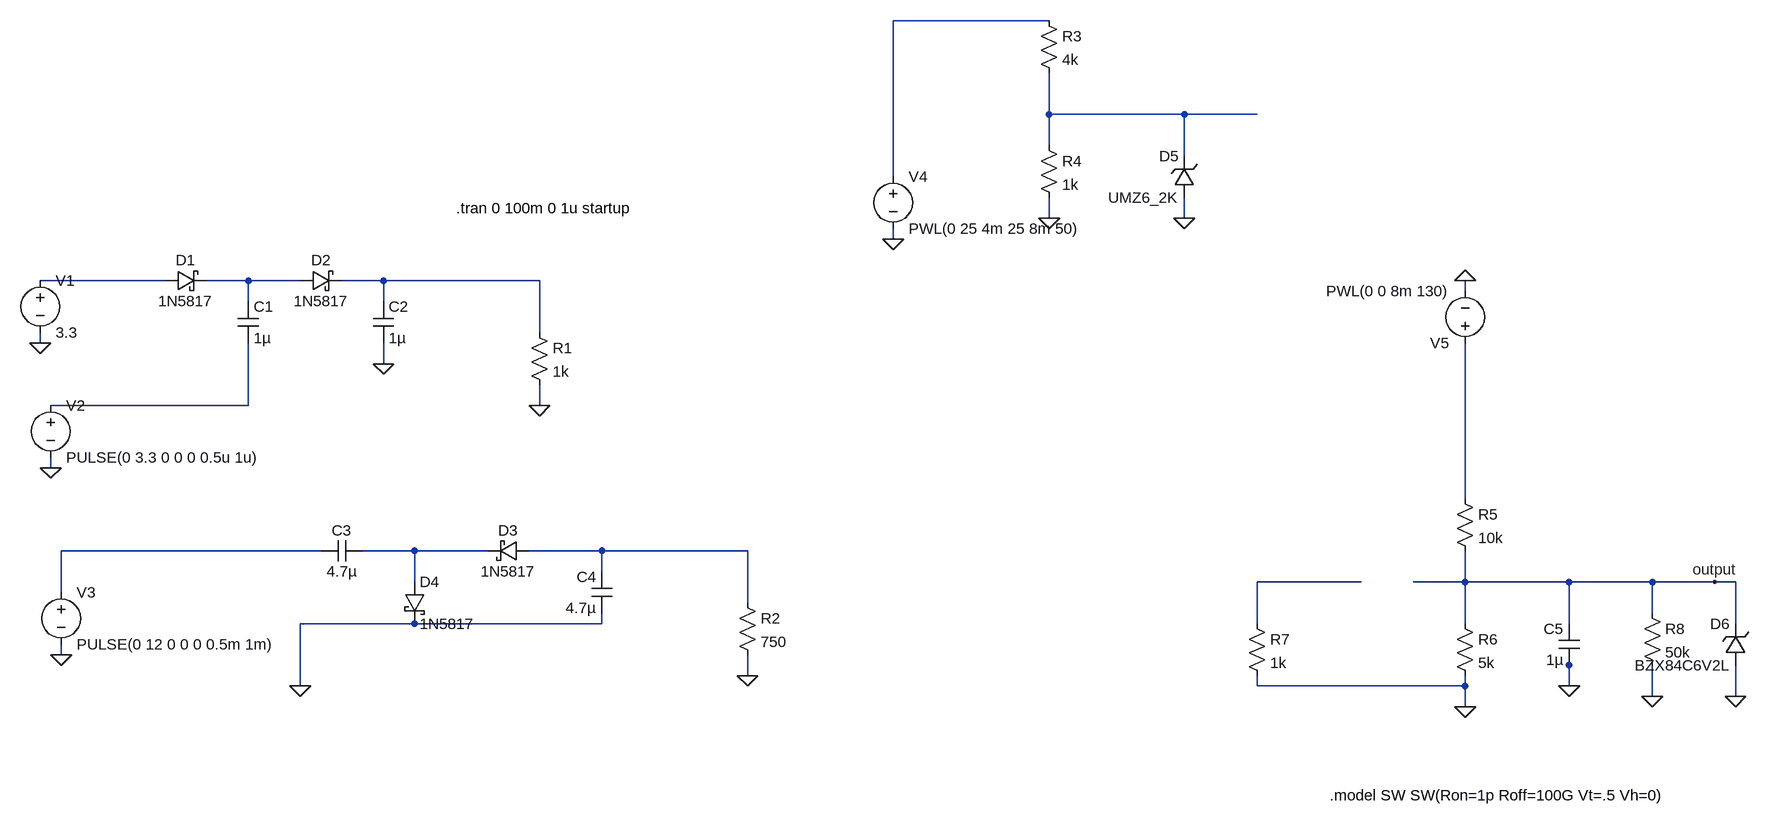
[diagram p0: schematic charge_pump.asc]
charge_pump.asc, the LTspice schematic file:
Version 4
SHEET 1 2736 1092
WIRE 1488 -224 1248 -224
WIRE 1488 -80 1488 -144
WIRE 1696 -80 1488 -80
WIRE 1808 -80 1696 -80
WIRE 1488 -32 1488 -80
WIRE 1696 -16 1696 -80
WIRE 1248 16 1248 -224
WIRE 1488 80 1488 48
WIRE 1696 80 1696 48
WIRE 1248 112 1248 96
WIRE 128 176 -64 176
WIRE 256 176 192 176
WIRE 336 176 256 176
WIRE 464 176 400 176
WIRE 704 176 464 176
WIRE 2128 192 2128 176
WIRE 256 208 256 176
WIRE 464 208 464 176
WIRE 704 256 704 176
WIRE -64 272 -64 256
WIRE 464 304 464 272
WIRE 256 368 256 272
WIRE 256 368 -48 368
WIRE 704 368 704 336
WIRE -48 464 -48 448
WIRE 2128 512 2128 272
WIRE 368 592 -32 592
WIRE 512 592 432 592
WIRE 624 592 512 592
WIRE 800 592 688 592
WIRE 1024 592 800 592
WIRE 800 624 800 592
WIRE 512 640 512 592
WIRE 1968 640 1808 640
WIRE 2128 640 2128 592
WIRE 2128 640 2048 640
WIRE 2288 640 2128 640
WIRE 2416 640 2288 640
WIRE 2512 640 2416 640
WIRE 2544 640 2512 640
WIRE -32 656 -32 592
WIRE 1024 672 1024 592
WIRE 2416 688 2416 640
WIRE 512 704 336 704
WIRE 800 704 800 688
WIRE 800 704 512 704
WIRE 1808 704 1808 640
WIRE 2128 704 2128 640
WIRE 2288 704 2288 640
WIRE 2544 704 2544 640
WIRE -32 752 -32 736
WIRE 2288 768 2288 752
WIRE 1024 784 1024 752
WIRE 336 800 336 704
WIRE 1808 800 1808 784
WIRE 2128 800 2128 784
WIRE 2128 800 1808 800
WIRE 2288 800 2288 768
WIRE 2416 816 2416 768
WIRE 2544 816 2544 768
WIRE 2128 832 2128 800
FLAG 704 368 0
FLAG 464 304 0
FLAG -48 464 0
FLAG -64 272 0
FLAG -32 752 0
FLAG 1024 784 0
FLAG 336 800 0
FLAG 1248 112 0
FLAG 1488 80 0
FLAG 1696 80 0
FLAG 2128 176 0
FLAG 2128 832 0
FLAG 2416 816 0
FLAG 2544 816 0
FLAG 2288 800 0
FLAG 2512 640 output
SYMBOL schottky 128 192 R270
WINDOW 0 32 32 VTop 2
WINDOW 3 0 32 VBottom 2
SYMATTR InstName D1
SYMATTR Value 1N5817
SYMATTR Description Diode
SYMATTR Type diode
SYMBOL schottky 336 192 R270
WINDOW 0 32 32 VTop 2
WINDOW 3 0 32 VBottom 2
SYMATTR InstName D2
SYMATTR Value 1N5817
SYMATTR Description Diode
SYMATTR Type diode
SYMBOL voltage -64 160 R0
WINDOW 123 0 0 Left 0
WINDOW 39 0 0 Left 0
SYMATTR InstName V1
SYMATTR Value 3.3
SYMBOL voltage -48 352 R0
WINDOW 123 0 0 Left 0
WINDOW 39 0 0 Left 0
SYMATTR InstName V2
SYMATTR Value PULSE(0 3.3 0 0 0 0.5u 1u)
SYMBOL res 688 240 R0
SYMATTR InstName R1
SYMATTR Value 1k
SYMBOL cap 240 208 R0
SYMATTR InstName C1
SYMATTR Value 1µ
SYMBOL cap 448 208 R0
SYMATTR InstName C2
SYMATTR Value 1µ
SYMBOL voltage -32 640 R0
WINDOW 123 0 0 Left 0
WINDOW 39 0 0 Left 0
SYMATTR InstName V3
SYMATTR Value PULSE(0 12 0 0 0 0.5m 1m)
SYMBOL schottky 688 576 R90
WINDOW 0 0 32 VBottom 2
WINDOW 3 32 32 VTop 2
SYMATTR InstName D3
SYMATTR Value 1N5817
SYMATTR Description Diode
SYMATTR Type diode
SYMBOL schottky 496 640 R0
SYMATTR InstName D4
SYMATTR Value 1N5817
SYMATTR Description Diode
SYMATTR Type diode
SYMBOL cap 432 576 R90
WINDOW 0 0 32 VBottom 2
WINDOW 3 32 32 VTop 2
SYMATTR InstName C3
SYMATTR Value 4.7µ
SYMBOL cap 816 688 R180
WINDOW 0 24 56 Left 2
WINDOW 3 24 8 Left 2
SYMATTR InstName C4
SYMATTR Value 4.7µ
SYMBOL res 1008 656 R0
SYMATTR InstName R2
SYMATTR Value 750
SYMBOL voltage 1248 0 R0
WINDOW 123 0 0 Left 0
WINDOW 39 0 0 Left 0
SYMATTR InstName V4
SYMATTR Value PWL(0 25 4m 25 8m 50)
SYMBOL zener 1712 48 R180
WINDOW 0 24 64 Left 2
WINDOW 3 24 0 Left 2
SYMATTR InstName D5
SYMATTR Value UMZ6_2K
SYMATTR Description Diode
SYMATTR Type diode
SYMBOL res 1472 -240 R0
SYMATTR InstName R3
SYMATTR Value 4k
SYMBOL res 1472 -48 R0
SYMATTR InstName R4
SYMATTR Value 1k
SYMBOL voltage 2128 288 R180
WINDOW 123 0 0 Left 0
WINDOW 39 0 0 Left 0
SYMATTR InstName V5
SYMATTR Value PWL(0 0 8m 130)
SYMBOL res 2112 496 R0
SYMATTR InstName R5
SYMATTR Value 10k
SYMBOL res 2112 688 R0
SYMATTR InstName R6
SYMATTR Value 5k
SYMBOL res 2400 672 R0
SYMATTR InstName R8
SYMATTR Value 50k
SYMBOL zener 2560 768 R180
WINDOW 0 24 64 Left 2
WINDOW 3 24 0 Left 2
SYMATTR InstName D6
SYMATTR Value BZX84C6V2L
SYMATTR Description Diode
SYMATTR Type diode
SYMBOL res 1792 688 R0
SYMATTR InstName R7
SYMATTR Value 1k
SYMBOL cap 2304 768 R180
WINDOW 0 24 56 Left 2
WINDOW 3 24 8 Left 2
SYMATTR InstName C5
SYMATTR Value 1µ
TEXT 576 64 Left 2 !.tran 0 100m 0 1u startup
TEXT 1920 968 Left 2 !.model SW SW(Ron=1p Roff=100G Vt=.5 Vh=0)

The netlist it stands for:
* charge_pump.asc
D1 N003 N004 1N5817
D2 N004 N005 1N5817
V1 N003 0 3.3
V2 N006 0 PULSE(0 3.3 0 0 0 0.5u 1u)
R1 N005 0 1k
C1 N004 N006 1µ
C2 N005 0 1µ
V3 N008 0 PULSE(0 12 0 0 0 0.5m 1m)
D3 N010 N009 1N5817
D4 N009 0 1N5817
C3 N009 N008 4.7µ
C4 0 N010 4.7µ
R2 N010 0 750
V4 N001 0 PWL(0 25 4m 25 8m 50)
D5 0 N002 UMZ6_2K
R3 N001 N002 4k
R4 N002 0 1k
V5 N007 0 PWL(0 0 8m 130)
R5 N007 output 10k
R6 output 0 5k
R8 output 0 50k
D6 0 output BZX84C6V2L
R7 N011 0 1k
C5 0 output 1µ
.model D D
.lib standard.dio
.tran 0 100m 0 1u startup
.model SW SW(Ron=1p Roff=100G Vt=.5 Vh=0)
.backanno
.end